# Altium schematic sheet Sheet1.SchDoc
size A; SheetNumber: 1; SheetTotal: 1
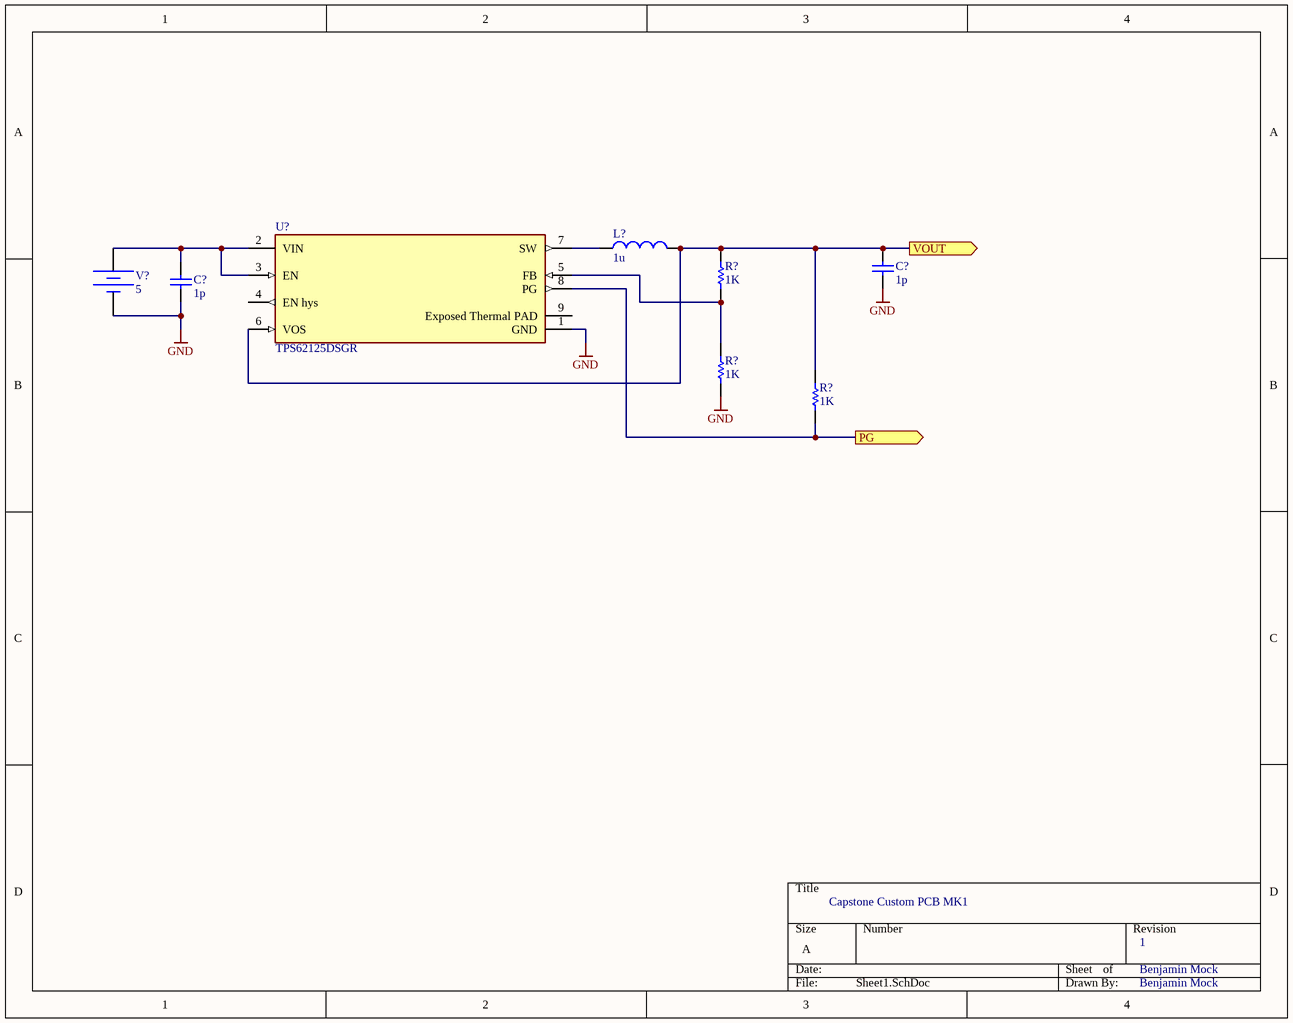
[diagram p0: Sheet1.SchDoc]

## Parts
(Parts that share a designator on the sheet are numbered #1, #2 ... from top to bottom, then left to right.)
C?#1  value 1p  (hidden comment: Capacitor)
C?#2  value 1p  (hidden comment: Capacitor)
L?  value 1u  (hidden comment: Inductor)
R?#1  value 1K  (hidden comment: Resistor)
R?#2  value 1K  (hidden comment: Resistor)
R?#3  value 1K  (hidden comment: Resistor)
U?  TPS62125DSGR  [FP-DSG0008A-MFG]
V?  DC Magnitude: 5  (hidden comment: Constant Voltage Source)

## Ports
PG (out), VOUT (out)

## Nets
GND: C?#1.2 C?#2.2 R?#2.2 U?.1(GND) V?.2
PG: R?#3.2 U?.8(PG) ; port PG
VOUT: C?#1.1 L?.2 R?#1.1 R?#3.1 U?.6(VOS) ; port VOUT
NetC?#2_1: C?#2.1 U?.2(VIN) U?.3(EN) V?.1
NetL?_1: L?.1 U?.7(SW)
NetR?#1_2: R?#1.2 R?#2.1 U?.5(FB)

Not connected (* = marked no-connect by the designer): U? 4(EN_hys) 9(Exposed_Thermal_PAD)

## Notes on the sheet
- Capstone Custom PCB MK1
- Benjamin Mock
- 1

## Library data of the parts
C?#1 C?#2 = Capacitor: SimulationGenericComponent: True
L? = Inductor: SimulationGenericComponent: True
R?#1-R?#3 = Resistor: TC1: 0; SimulationGenericComponent: True; TC2: 0
U? = CMP-04918-000040-2: IC REG BUCK ADJ 300MA 8WSON; Min Output Voltage: 1.2V; Min Input Voltage: 3V; Quiescent Current: 13uA; Number of Outputs: 1; Output Voltage: 10V; Output Configuration: Positive; Synchronous Rectifier: Yes; Output Type: Adjustable; Max Input Voltage: 17V; Switching Frequency: 1MHz; Number of Pins: 8; Max Operating Temperature: 85°C; Output Current: 300mA; Package Quantity: 3000; Radiation Hardening: No; Lead Free: Lead Free; Contact Plating: Gold; Max Output Current: 300mA; Max Output Voltage: 10V; Mount: Surface Mount; Min Operating Temperature: -40°C; Packaging: Tape and Reel
V? = Battery: SimulationGenericComponent: True